# EAGLE design RCPYAdapter (EAGLE 6.5.0)
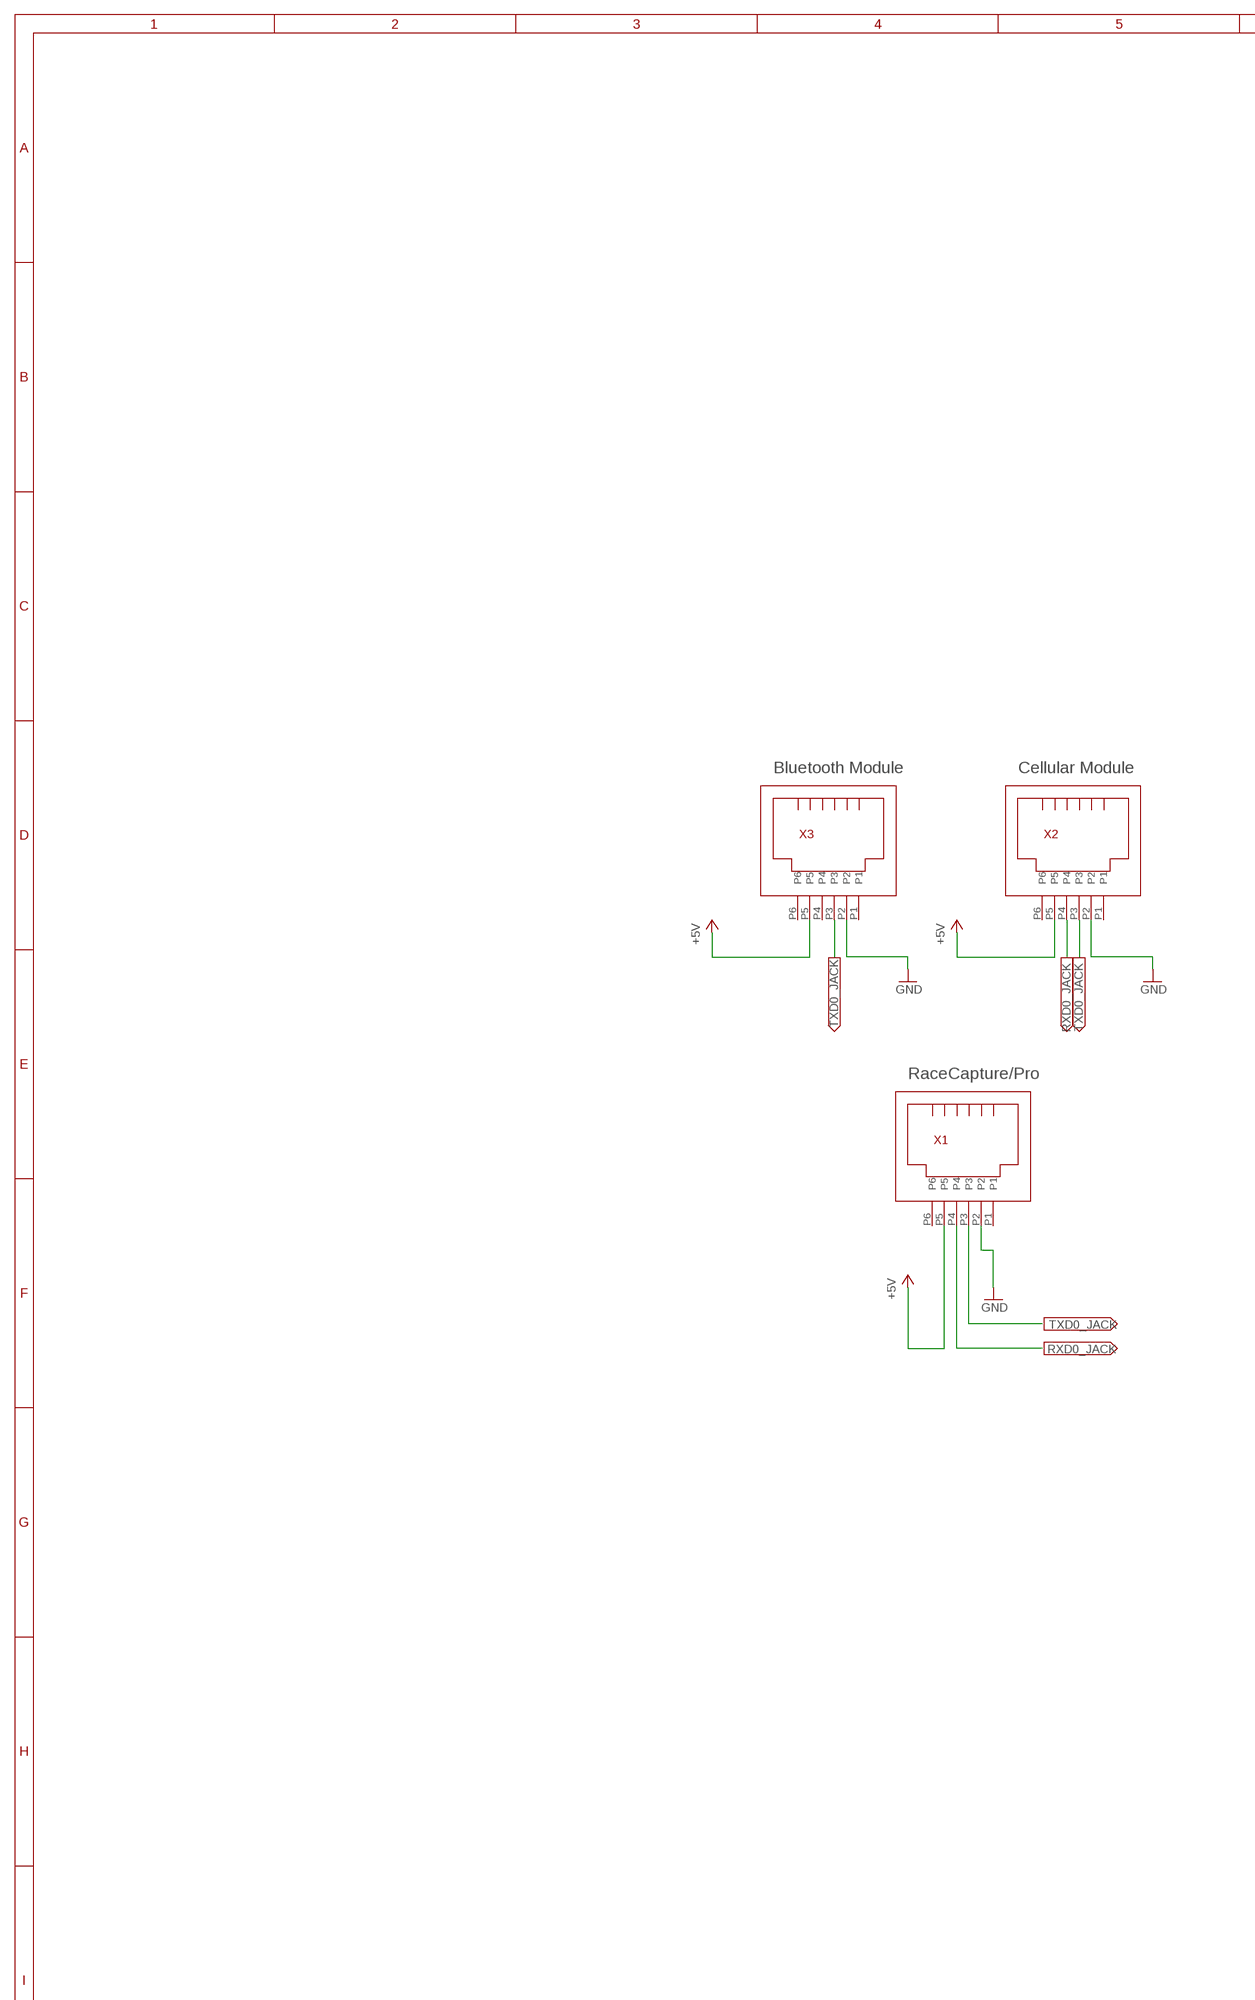
[diagram p0: schematic, sheet 1, part 1 of 2]
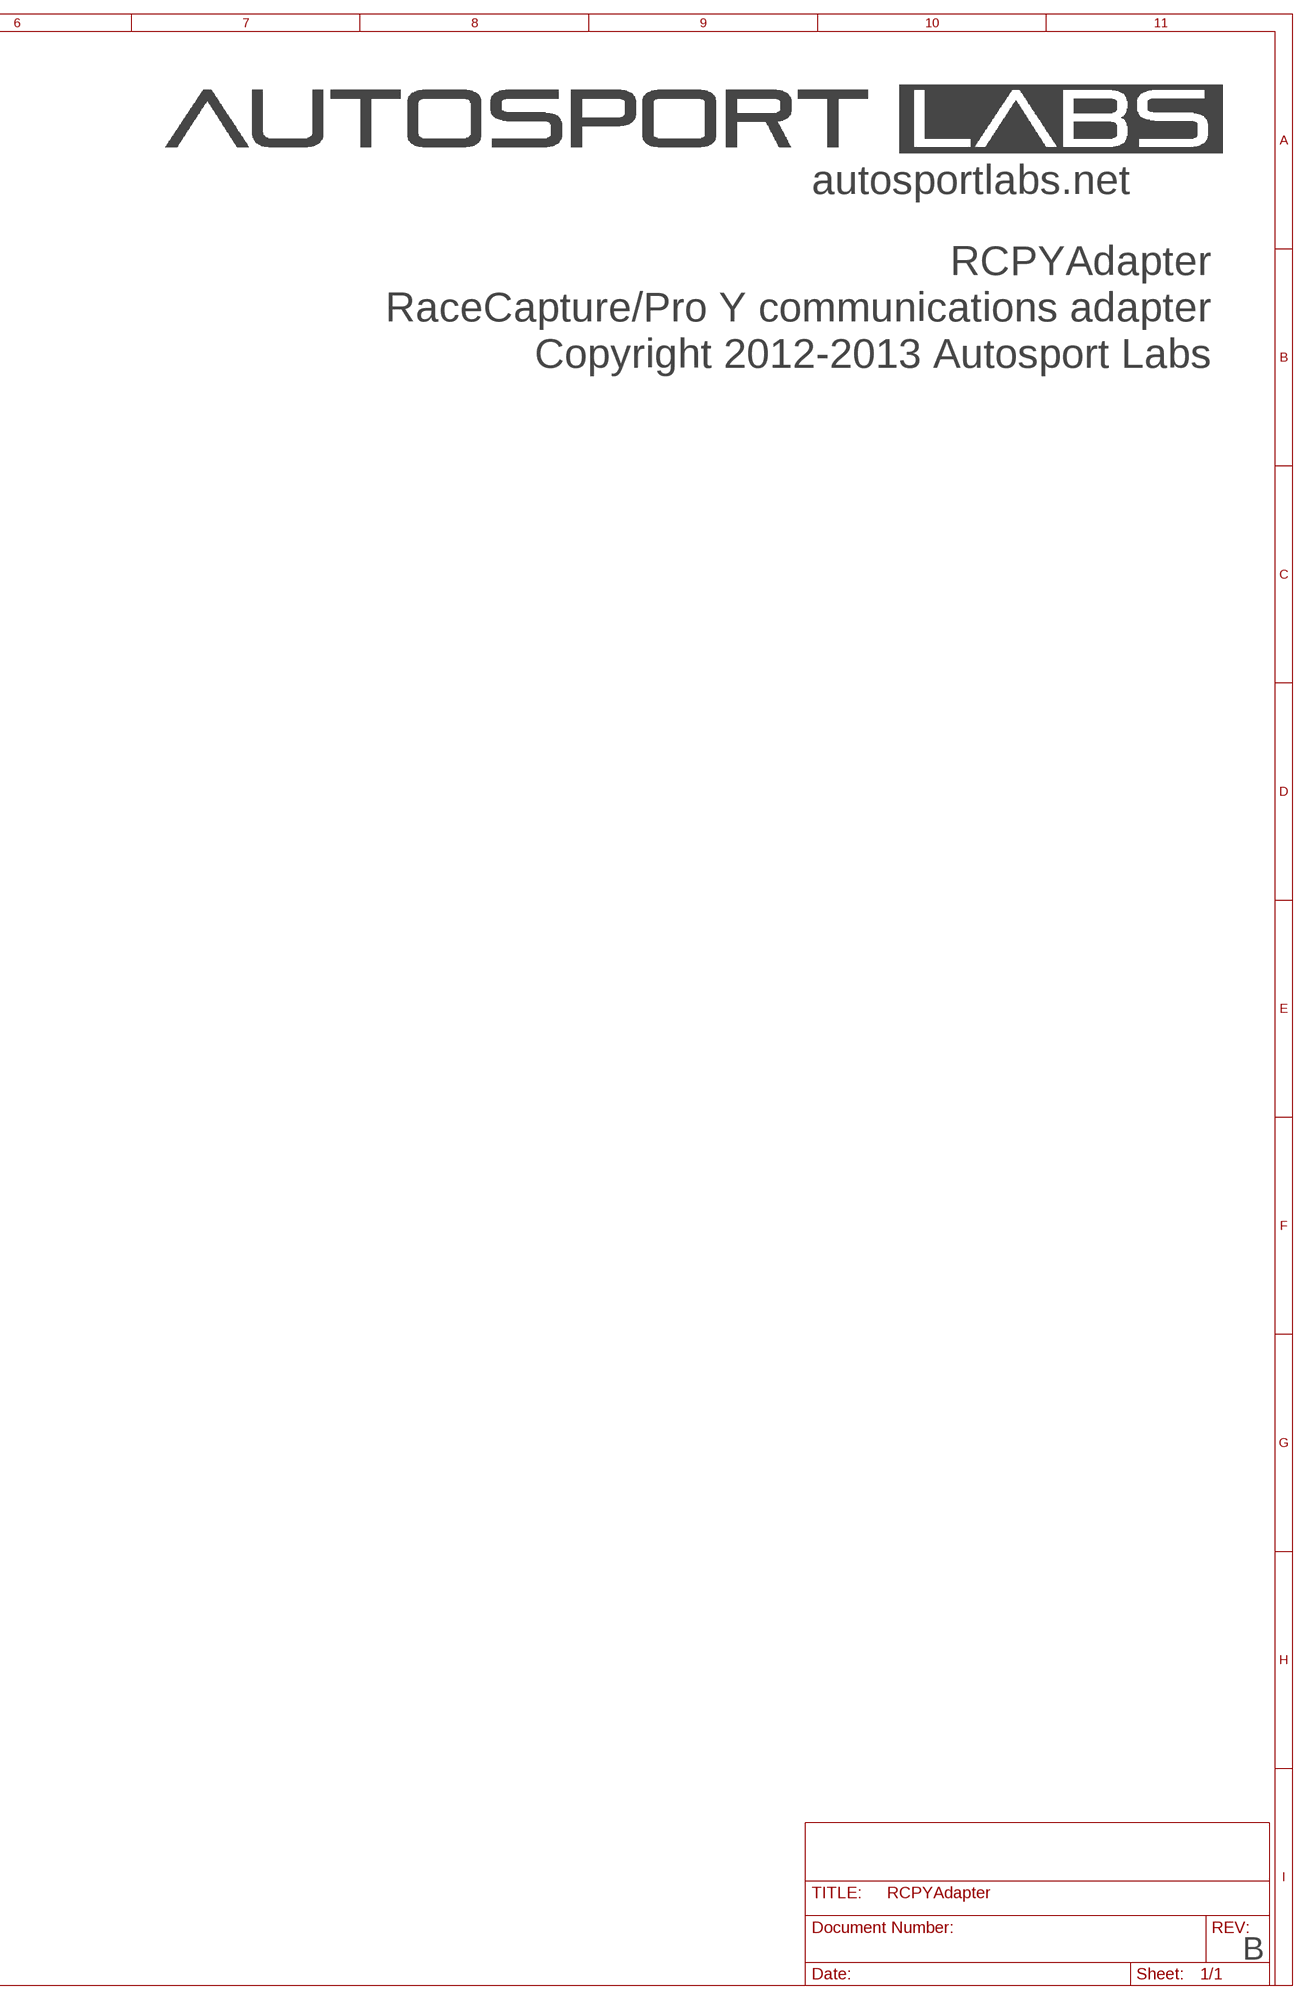
[diagram p1: schematic, sheet 1, part 2 of 2]

## Parts
X1  FCI_88400_066LF_RJ12_4POS  [RJ12_RIGHT_ANGLE_PCB]
X2  FCI_88400_066LF_RJ12_4POS  [RJ12_RIGHT_ANGLE_PCB]
X3  FCI_88400_066LF_RJ12_4POS  [RJ12_RIGHT_ANGLE_PCB]

## Nets
+5V: X1.P5 X2.P5 X3.P5
GND: X1.P2 X2.P2 X3.P2
RXD0_JACK: X1.P4 X2.P4
TXD0_JACK: X1.P3 X2.P3 X3.P3
Unconnected: X1.P1 X1.P6 X2.P1 X2.P6 X3.P1 X3.P4 X3.P6

## Notes on the sheet
- autosportlabs.net
- RCPYAdapter
- RaceCapture/Pro Y communications adapter
- Copyright 2012-2013 Autosport Labs
- Bluetooth Module | Cellular Module
- RaceCapture/Pro
- B

## Library data of the parts
X1-X3 = FCI_RJ12:FCI_88400_066LF_RJ12_4POS

## Board
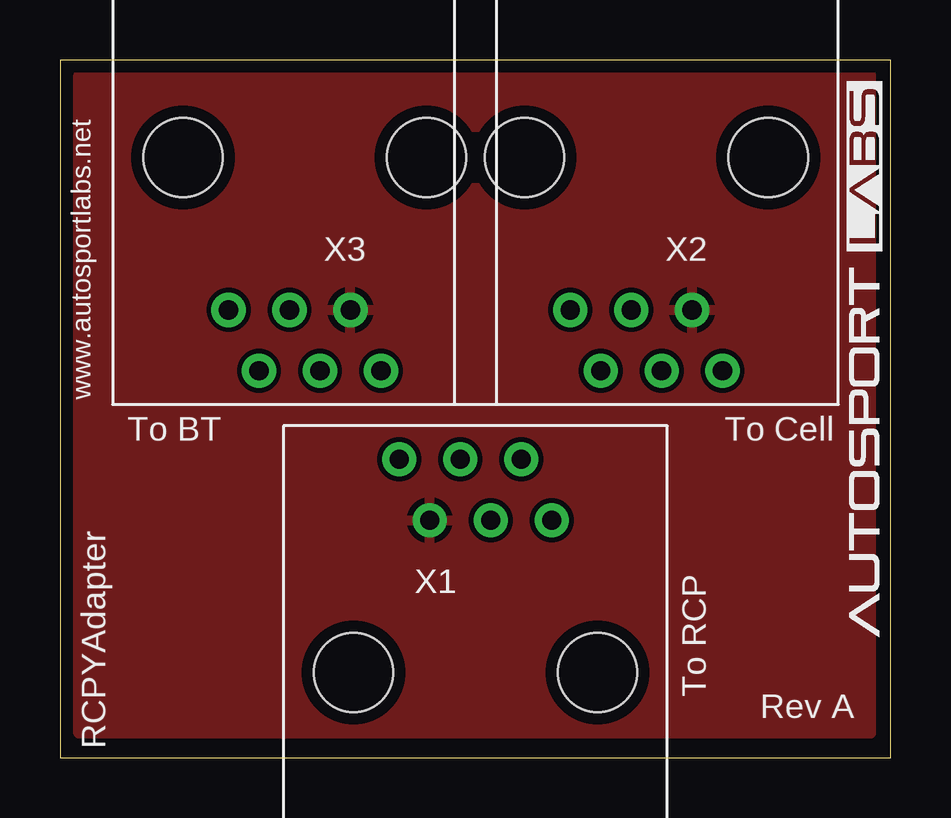
[diagram p2: board, top side]
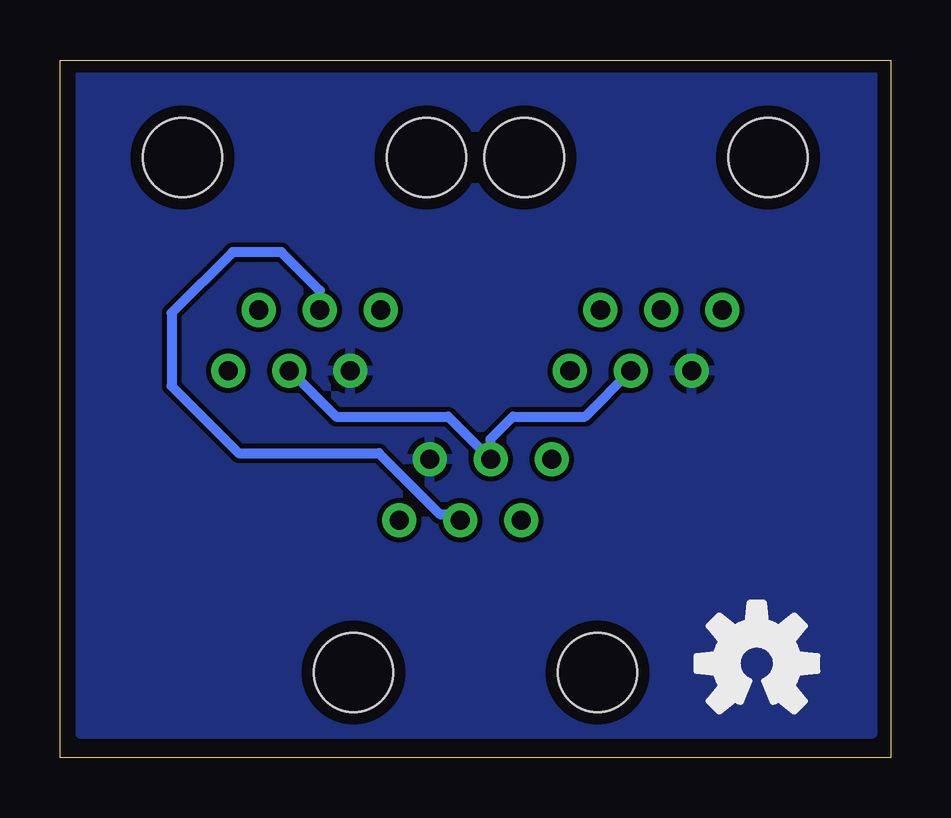
[diagram p3: board, bottom side, seen from below]

Size 34.62 x 29.08 mm. Coordinates in mm from the lower left corner, seen from the top.
Outline: 0,0 34.62,0 34.62,29.08 0,29.08 0,0
Copper layers (1*16): Top 0.035mm / dielectric 1.5mm / Bottom 0.035mm
Design rules "default *": minimum track width 10mil, minimum drill 18mil, track to track 8mil, track to pad 8mil, pad to pad 8mil, via to via 8mil, smd to smd 8mil, copper to edge 20mil, drill to drill 8mil, minimum pad ring 10mil, minimum via ring 8mil, stop-mask expansion 4mil, vias tented up to drill 20mil, thermal gap 10mil

### Footprints (pad centres in the part's own frame; a part is rotated, then mirrored left to right if it is on the bottom)
RJ12_RIGHT_ANGLE_PCB = drill 0.8 pad 1.422: P1 -3.175,8.89; P2 -1.905,6.35; P3 -0.635,8.89; P4 0.635,6.35; P5 1.905,8.89; P6 3.175,6.35 | hole 3.302: -5.08,0; 5.08,0

### Placement (x,y rotation side)
X1  17.31,3.56 0 top
X2  24.43,25.02 180 top
X3  10.2,25.02 180 top

### Tracks (layer width: path | path; a pad name or v marks a point on that pad's centre or on a via)
+5V
  pour Bottom: 0.76,28.45 33.78,28.45 33.78,1.02 0.76,1.02
GND
  pour Top: 0.76,28.45 33.78,28.45 33.78,1.02 0.76,1.02
RXD0_JACK
  Bottom 0.406: X2.P4 23.8,19.48 25.4,21.08 27.43,21.08 29.97,18.54 29.97,15.49 27.18,12.7 21.34,12.7 18.8,10.16 18.2,10.16 X1.P4
TXD0_JACK
  Bottom 0.406: X3.P3 12.74,14.22 15.75,14.22 16.68,13.3 X1.P3 18.45,14.22 23.11,14.22 25.02,16.13 X2.P3

### Text on the board
tPlace: www.autosportlabs.net | To Cell | To BT | To RCP | Rev A | RCPYAdapter